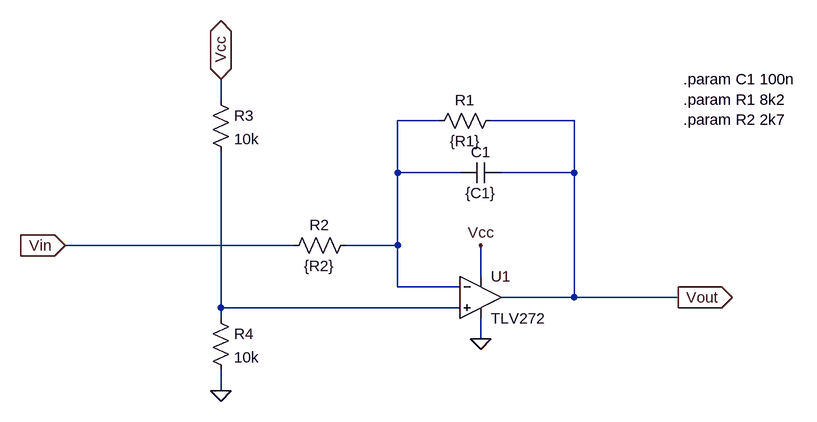
[diagram p0: schematic opamp_filter1.asc]
opamp_filter1.asc, the LTspice schematic file:
Version 4
SHEET 1 1140 680
WIRE 240 -80 240 -112
WIRE 576 -48 512 -48
WIRE 784 -48 656 -48
WIRE 512 32 512 -48
WIRE 608 32 512 32
WIRE 784 32 784 -48
WIRE 784 32 672 32
WIRE 352 144 0 144
WIRE 512 144 512 32
WIRE 512 144 432 144
WIRE 640 192 640 144
WIRE 512 208 512 144
WIRE 608 208 512 208
WIRE 784 224 784 32
WIRE 784 224 672 224
WIRE 944 224 784 224
WIRE 240 240 240 0
WIRE 608 240 240 240
WIRE 240 256 240 240
WIRE 640 288 640 256
WIRE 240 368 240 336
FLAG 240 368 0
FLAG 240 -112 Vcc
IOPIN 240 -112 BiDir
FLAG 640 288 0
FLAG 944 224 Vout
IOPIN 944 224 Out
FLAG 0 144 Vin
IOPIN 0 144 In
FLAG 640 144 Vcc
SYMBOL res 224 240 R0
SYMATTR InstName R4
SYMATTR Value 10k
SYMBOL res 224 -96 R0
SYMATTR InstName R3
SYMATTR Value 10k
SYMBOL res 336 160 R270
WINDOW 0 32 56 VTop 2
WINDOW 3 0 56 VBottom 2
SYMATTR InstName R2
SYMATTR Value {R2}
SYMBOL res 560 -32 R270
WINDOW 0 32 56 VTop 2
WINDOW 3 0 56 VBottom 2
SYMATTR InstName R1
SYMATTR Value {R1}
SYMBOL OpAmps\\TLV272 640 224 R0
SYMATTR InstName U1
SYMBOL cap 672 16 R90
WINDOW 0 0 32 VBottom 2
WINDOW 3 32 32 VTop 2
SYMATTR InstName C1
SYMATTR Value {C1}
TEXT 952 -112 Left 2 !.param C1 100n\n.param R1 8k2\n.param R2 2k7

The netlist it stands for:
* opamp_filter1.asc
R4 N002 0 10k
R3 Vcc N002 10k
R2 Vin N001 {R2}
R1 N001 Vout {R1}
* U1: TLV272 (symbol OpAmps\TLV272 not available, pins judged from their places): In+=N002 In-=N001 V+=Vcc V-=0 OUT=Vout
C1 Vout N001 {C1}
.param C1 100n
.param R1 8k2
.param R2 2k7
.backanno
.end